# EAGLE design PAPx2-2 (EAGLE 7.2.0)
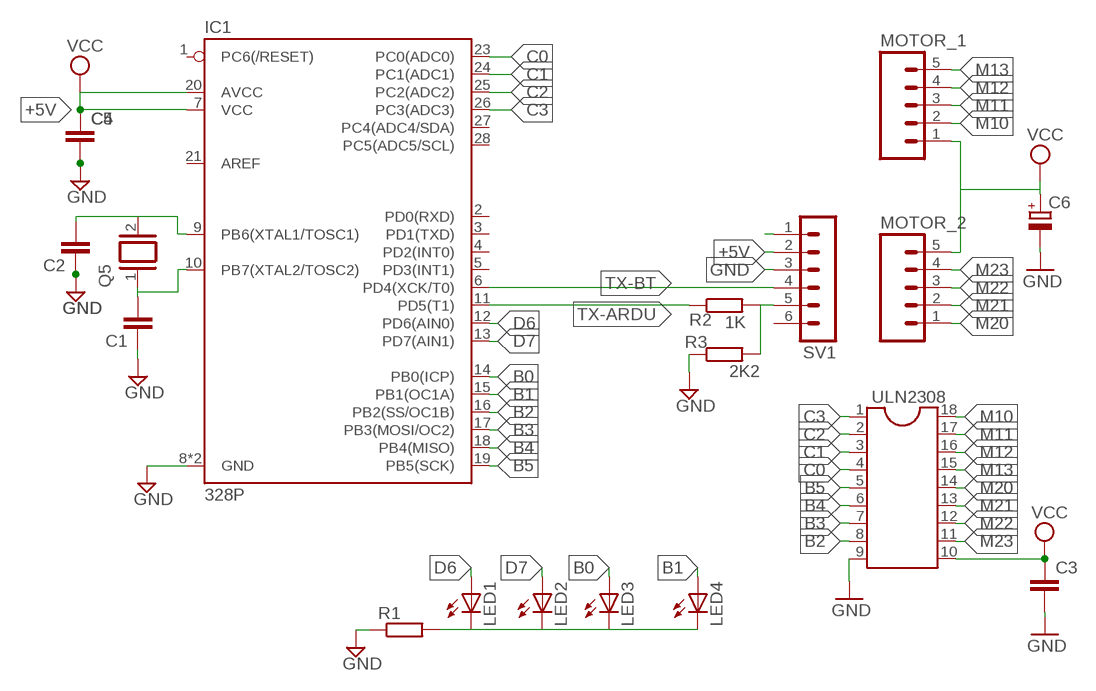
[diagram p0: schematic, sheet 1]

## Parts
C1  C-EU025-025X050  [C025-025X050]
C2  C-EU025-025X050  [C025-025X050]
C3  C-EU050-025X075  [C050-025X075]
C4  C-EU050-025X075  [C050-025X075]
C5  C-EU050-025X075  [C050-025X075]
C6  CPOL-EUE2.5-5  [E2,5-5]
IC1  328P  ATMEGA328P  [DIP28]
LED1  LED3MM  [LED_3MM]
LED2  LED3MM  [LED_3MM]
LED3  LED3MM  [LED_3MM]
LED4  LED3MM  [LED_3MM]
MOTOR_1  M05  [05P]
MOTOR_2  M05  [05P]
Q5  XTAL/S  [QS]
R1  R-EU_0207/7  [0207/7]
R2  1K  R-EU_0207/7  [0207/7]
R3  2K2  R-EU_0207/7  [0207/7]
SV1  MA06-1  [MA06-1]
ULN2308  DIL18  [DIL18]

## Nets
+5V: C4.1 C5.1 IC1.7(VCC) IC1.20(AVCC) SV1.2 ; supply symbol labelled VCC
B0: IC1.14(PB0(ICP)) LED3.A
B1: IC1.15(PB1(OC1A)) LED4.A
B2: IC1.16(PB2(SS/OC1B)) ULN2308.8
B3: IC1.17(PB3(MOSI/OC2)) ULN2308.7
B4: IC1.18(PB4(MISO)) ULN2308.6
B5: IC1.19(PB5(SCK)) ULN2308.5
C0: IC1.23(PC0(ADC0)) ULN2308.4
C1: IC1.24(PC1(ADC1)) ULN2308.3
C2: IC1.25(PC2(ADC2)) ULN2308.2
C3: IC1.26(PC3(ADC3)) ULN2308.1
D6: IC1.12(PD6(AIN0)) LED1.A
D7: IC1.13(PD7(AIN1)) LED2.A
GND: C1.1 C2.1 C3.2 C4.2 C5.2 C6.- IC1.8(GND) IC1.22(GND) R1.1 R3.1 SV1.3 ULN2308.9
M10: MOTOR_1.2 ULN2308.18
M11: MOTOR_1.3 ULN2308.17
M12: MOTOR_1.4 ULN2308.16
M13: MOTOR_1.5 ULN2308.15
M20: MOTOR_2.1 ULN2308.14
M21: MOTOR_2.2 ULN2308.13
M22: MOTOR_2.3 ULN2308.12
M23: MOTOR_2.4 ULN2308.11
N$1: R2.2 R3.2 SV1.5
N$2: C1.2 IC1.10(PB7(XTAL2/TOSC2)) Q5.1
N$3: C2.2 IC1.9(PB6(XTAL1/TOSC1)) Q5.2
N$7: LED1.K(C) LED2.K(C) LED3.K(C) LED4.K(C) R1.2
N$8: SV1.1
TX-ARDU: IC1.11(PD5(T1)) R2.1
TX-BT: IC1.6(PD4(XCK/T0)) SV1.4
VCC: C3.1 C6.+ MOTOR_1.1 MOTOR_2.5 ULN2308.10
Unconnected: IC1.1(PC6(/RESET)) IC1.2(PD0(RXD)) IC1.3(PD1(TXD)) IC1.4(PD2(INT0)) IC1.5(PD3(INT1)) IC1.21(AREF) IC1.27(PC4(ADC4/SDA)) IC1.28(PC5(ADC5/SCL)) SV1.6

## Library data of the parts
C1-C5 = rcl:C-EU: CAPACITOR, European symbol
C6 = resistor:CPOL-EU: POLARIZED CAPACITOR, European symbol
IC1 = treser_lib:ATMEGA328P: Atmel ATMEGA328P 32kb flash, 1k EEPROM, 2k SRAM; PROD_ID: IC-09136
LED1-LED4 = treser_lib:LED: LEDs
MOTOR_1 MOTOR_2 = con-amp-quick:M05: AMP QUICK CONNECTOR; OC_FARNELL: unknown; OC_NEWARK: unknown
Q5 = special:XTAL/S: CRYSTAL
R1 = rcl:R-EU_: RESISTOR, European symbol
R2 R3 = resistor:R-EU_: RESISTOR, European symbol
SV1 = con-lstb:MA06-1: PIN HEADER; OC_FARNELL: unknown; OC_NEWARK: unknown
ULN2308 = ic-package:DIL18: Dual In Line / Socket

## Board
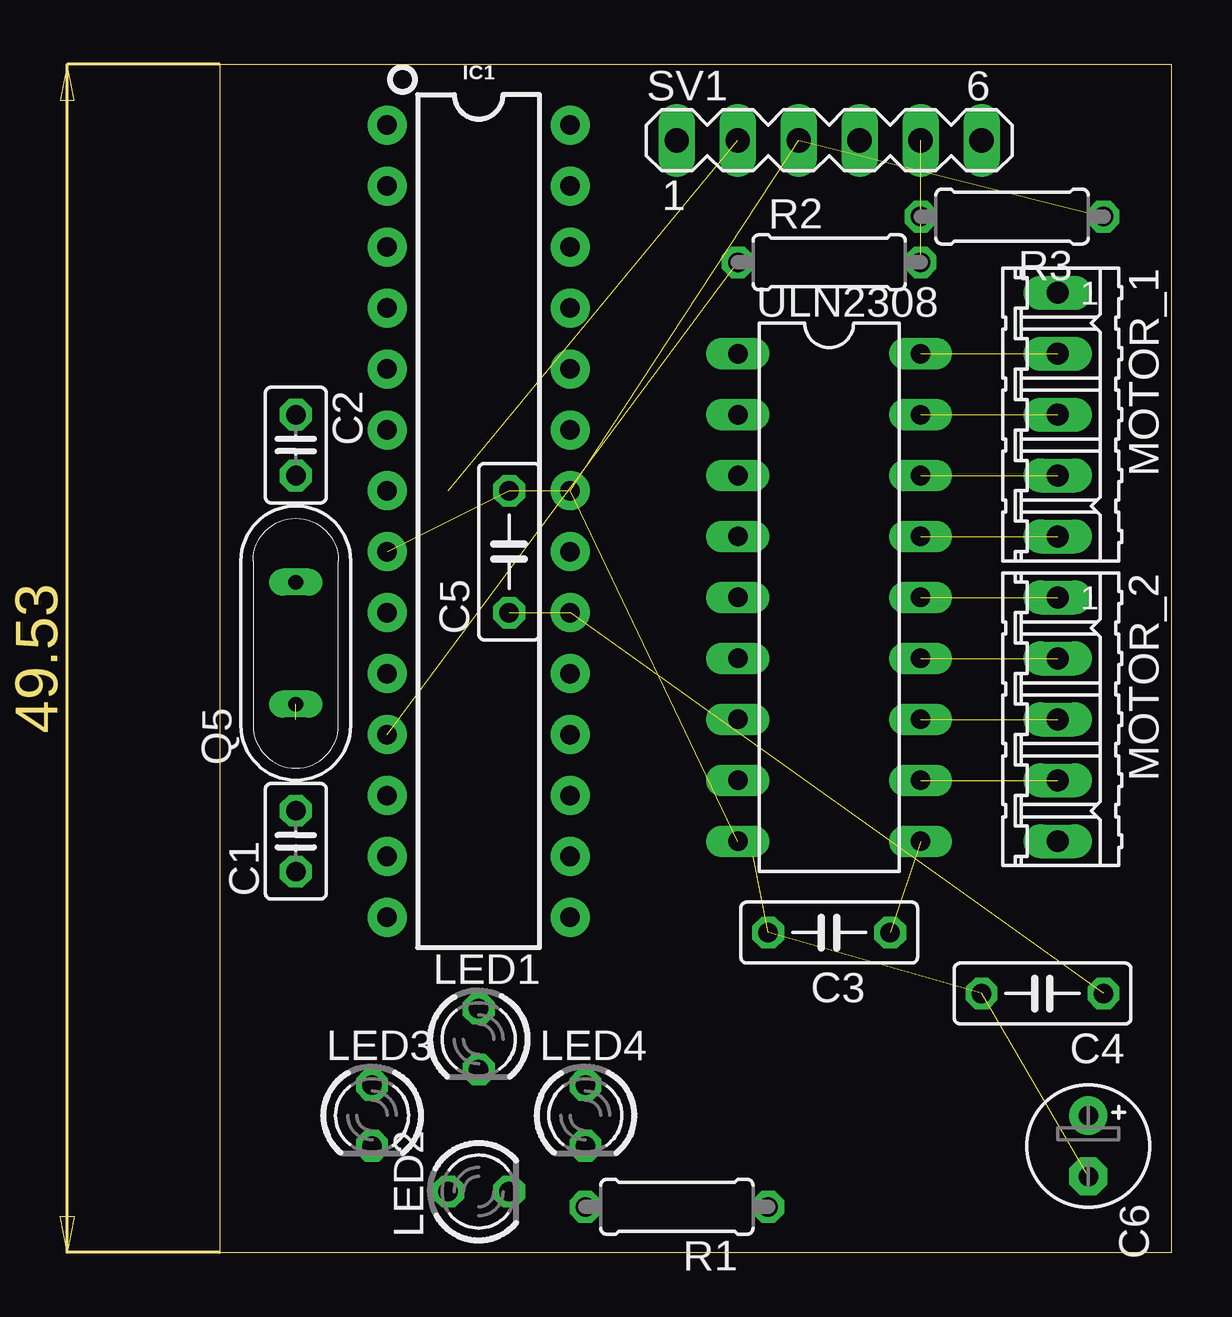
[diagram p1: board, top side]
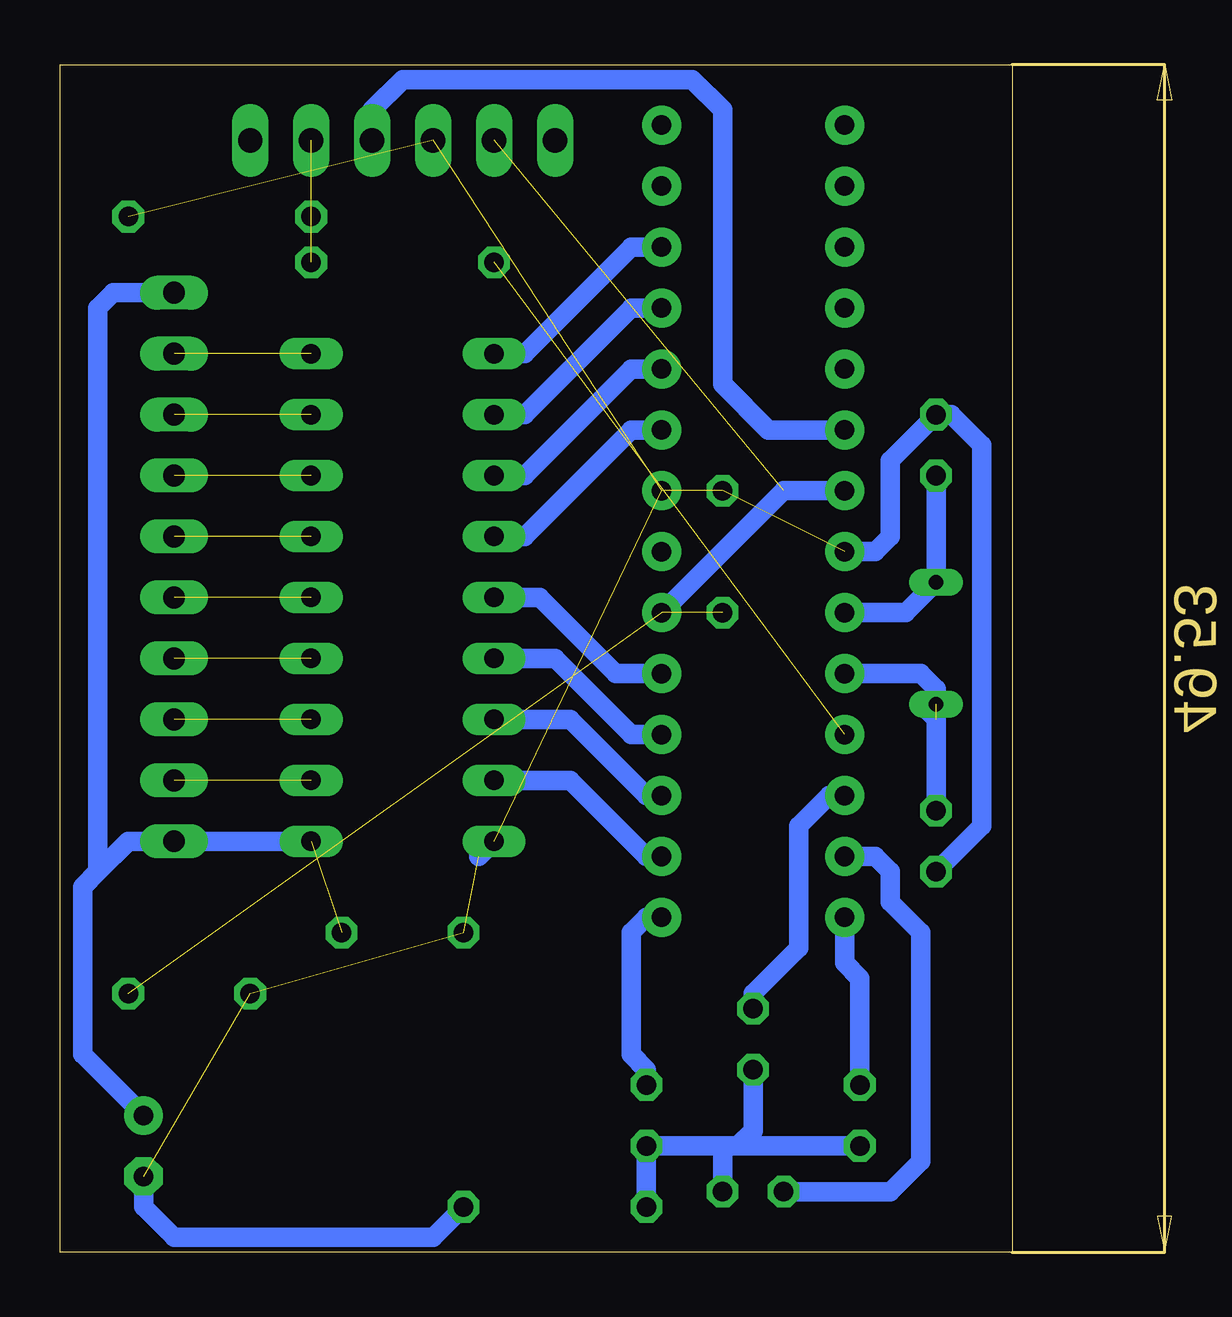
[diagram p2: board, bottom side, seen from below]

Size 39.67 x 49.52 mm. Coordinates in mm from the lower left corner, seen from the top.
Outline: 0,0 39.67,0 39.67,49.52 0,49.52 0,0
Copper layers (1*16): Top 0.035mm / dielectric 1.5mm / Bottom 0.035mm
Design rules "default": minimum track width 10mil, minimum drill 24mil, track to track 8mil, track to pad 8mil, pad to pad 8mil, via to via 8mil, smd to smd 8mil, copper to edge 40mil, drill to drill 8mil, minimum pad ring 10mil, minimum via ring 8mil, stop-mask expansion 4mil, vias tented up to drill 0mil, thermal gap 10mil

### Footprints (pad centres in the part's own frame; a part is rotated, then mirrored left to right if it is on the bottom)
C025-025X050 = drill 0.813 octagon: 1 -1.27,0; 2 1.27,0
C050-025X075 = drill 0.813 octagon: 1 -2.54,0; 2 2.54,0
E2,5-5 = drill 0.813 pad 1.6: + -1.27,0 | drill 0.813 pad 1.6 octagon: - 1.27,0
DIP28 = drill 0.813 pad 1.626: 1 -16.51,-3.81; 2 -13.97,-3.81; 3 -11.43,-3.81; 4 -8.89,-3.81; 5 -6.35,-3.81; 6 -3.81,-3.81; 7 -1.27,-3.81; 8 1.27,-3.81; 9 3.81,-3.81; 10 6.35,-3.81; 11 8.89,-3.81; 12 11.43,-3.81; 13 13.97,-3.81; 14 16.51,-3.81; 15 16.51,3.81; 16 13.97,3.81; 17 11.43,3.81; 18 8.89,3.81; 19 6.35,3.81; 20 3.81,3.81; 21 1.27,3.81; 22 -1.27,3.81; 23 -3.81,3.81; 24 -6.35,3.81; 25 -8.89,3.81; 26 -11.43,3.81; 27 -13.97,3.81; 28 -16.51,3.81
LED_3MM = drill 0.813 octagon: A -1.27,0; K 1.27,0
05P = drill 0.914 long: 1 -5.08,0; 2 -2.54,0; 3 0,0; 4 2.54,0; 5 5.08,0
QS = drill 0.61 long: 1 -2.54,0; 2 2.54,0
0207/7 = drill 0.813 octagon: 1 -3.81,0; 2 3.81,0
MA06-1 = drill 1.016 long: 1 -6.35,0; 2 -3.81,0; 3 -1.27,0; 4 1.27,0; 5 3.81,0; 6 6.35,0
DIL18 = drill 0.813 long: 1 -10.16,-3.81; 2 -7.62,-3.81; 3 -5.08,-3.81; 4 -2.54,-3.81; 5 0,-3.81; 6 2.54,-3.81; 7 5.08,-3.81; 8 7.62,-3.81; 9 10.16,-3.81; 10 10.16,3.81; 11 7.62,3.81; 12 5.08,3.81; 13 2.54,3.81; 14 0,3.81; 15 -2.54,3.81; 16 -5.08,3.81; 17 -7.62,3.81; 18 -10.16,3.81

### Placement (x,y rotation side)
C1  3.18,17.14 90 top
C2  3.18,33.66 270 top
C3  25.4,13.34 180 top
C4  34.29,10.79 180 top
C5  12.06,29.21 90 top
C6  36.19,4.45 270 top
IC1  10.79,30.48 270 top
LED1  10.79,8.89 270 top
LED2  10.79,2.54 0 top
LED3  6.35,5.71 270 top
LED4  15.24,5.71 270 top
MOTOR_1  34.92,34.92 270 top
MOTOR_2  34.92,22.23 270 top
Q5  3.18,25.4 90 top
R1  19.05,1.9 180 top
R2  25.4,41.27 0 top
R3  33.02,43.18 180 top
SV1  25.4,46.35 0 top
ULN2308  25.4,27.3 270 top

### Tracks (layer width: path | path; a pad name or v marks a point on that pad's centre or on a via)
+5V  (3 unrouted)
  Bottom 0.813: IC1.7 9.52,31.75 IC1.20
B0
  Bottom 0.813: LED3.A 6.35,11.43 6.98,12.06 IC1.14
B1
  Bottom 0.813: LED4.A 15.24,7.62 15.87,8.25 15.87,13.34 15.24,13.97 IC1.15
B2
  Bottom 0.813: IC1.16 15.24,16.51 18.42,19.69 ULN2308.8
B3
  Bottom 0.813: IC1.17 15.24,19.05 18.42,22.23 ULN2308.7
B4
  Bottom 0.813: IC1.18 15.87,21.59 19.05,24.77 ULN2308.6
B5
  Bottom 0.813: IC1.19 16.51,24.13 19.68,27.3 ULN2308.5
C0
  Bottom 0.813: ULN2308.4 20.32,29.84 15.87,34.29 IC1.23
C1
  Bottom 0.813: ULN2308.3 20.32,32.38 15.87,36.83 IC1.24
C2
  Bottom 0.813: ULN2308.2 20.32,34.92 15.87,39.37 IC1.25
C3
  Bottom 0.813: ULN2308.1 20.32,37.46 15.87,41.91 IC1.26
D6
  Bottom 0.813: LED1.A 10.79,10.79 8.89,12.7 8.89,17.78 7.62,19.05 IC1.12
D7
  Bottom 0.813: IC1.13 5.71,16.51 5.08,15.88 5.08,14.61 3.81,13.34 3.81,3.81 5.08,2.54 LED2.A
GND  (8 unrouted)
  Bottom 0.813: 22.22,16.51 ULN2308.9 | C6.- 36.19,1.9 34.92,0.63 24.13,0.63 R1.1 | IC1.8 5.71,29.21 5.08,29.84 5.08,33.02 C2.1 2.54,34.92 1.27,33.66 1.27,17.78 C1.1
M10  (1 unrouted)
M11  (1 unrouted)
M12  (1 unrouted)
M13  (1 unrouted)
M20  (1 unrouted)
M21  (1 unrouted)
M22  (1 unrouted)
M23  (1 unrouted)
N$1  (2 unrouted)
N$2  (1 unrouted)
  Bottom 0.813: C1.2 3.18,22.23 3.81,22.86 | Q5.1 3.18,23.49 3.81,24.13 IC1.10
N$3
  Bottom 0.813: IC1.9 4.45,26.67 Q5.2 C2.2
N$7
  Bottom 0.813: LED3.K 11.43,4.45 | 11.43,4.45 12.06,4.45 | 12.06,4.45 LED4.K R1.2 | LED2.K 12.06,4.45 | LED1.K 10.79,5.08 11.43,4.45
TX-ARDU  (1 unrouted)
TX-BT
  Bottom 0.813: IC1.6 10.16,34.29 12.06,36.2 12.06,47.62 13.33,48.89 25.4,48.89 26.67,47.62 SV1.4
VCC  (1 unrouted)
  Bottom 0.813: C6.+ 38.73,8.25 38.73,15.24 38.1,15.88 | 38.1,15.88 36.83,17.14 MOTOR_2.5 ULN2308.10 | MOTOR_1.1 37.47,40.01 38.1,39.37 38.1,15.88